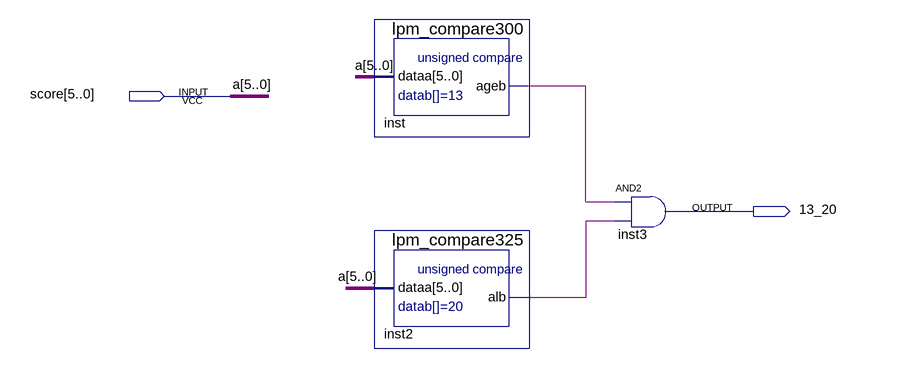
[diagram p0: schematic sheet]
// Quartus schematic 13_20_compare.bdf as structural Verilog: 3 symbols, 2 pins
module \13_20_compare  (
  input  [5:0] score,
  output \13_20 
);

  wire inst2_alb, inst_ageb;

  lpm_compare300 inst (.dataa(score), .ageb(inst_ageb));
  lpm_compare325 inst2 (.dataa(score), .alb(inst2_alb));
  and inst3 (\13_20 , inst_ageb, inst2_alb);

  // Other names for the same wires on the sheet: a[5:0] = score
endmodule
